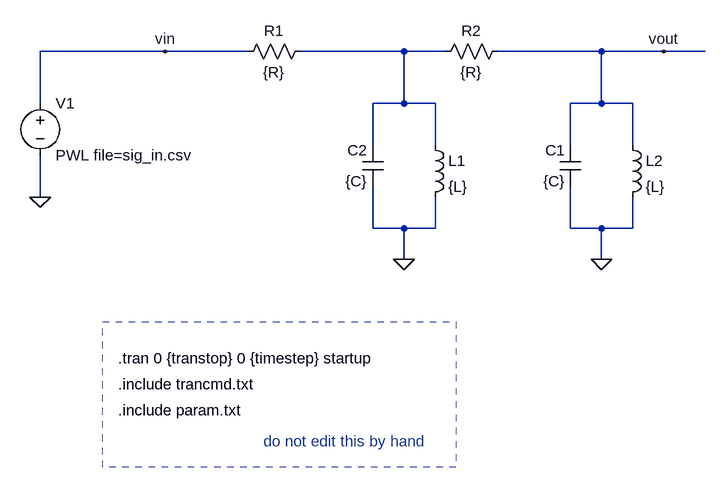
[diagram p0: schematic filter_circuit_2.asc]
filter_circuit_2.asc, the LTspice schematic file:
Version 4
SHEET 1 1364 740
WIRE 304 96 112 96
WIRE 432 96 304 96
WIRE 672 96 512 96
WIRE 736 96 672 96
WIRE 976 96 816 96
WIRE 1072 96 976 96
WIRE 1136 96 1072 96
WIRE 112 176 112 96
WIRE 672 176 672 96
WIRE 672 176 624 176
WIRE 720 176 672 176
WIRE 976 176 976 96
WIRE 976 176 928 176
WIRE 1024 176 976 176
WIRE 624 240 624 176
WIRE 720 240 720 176
WIRE 928 240 928 176
WIRE 1024 240 1024 176
WIRE 112 320 112 256
WIRE 624 368 624 304
WIRE 672 368 624 368
WIRE 720 368 720 320
WIRE 720 368 672 368
WIRE 928 368 928 304
WIRE 976 368 928 368
WIRE 1024 368 1024 320
WIRE 1024 368 976 368
WIRE 672 416 672 368
WIRE 976 416 976 368
FLAG 304 96 vin
FLAG 112 320 0
FLAG 672 416 0
FLAG 1072 96 vout
FLAG 976 416 0
SYMBOL voltage 112 160 R0
WINDOW 39 0 0 Left 0
SYMATTR InstName V1
SYMATTR Value PWL file=sig_in.csv
SYMBOL cap 640 304 R180
WINDOW 0 24 56 Left 2
WINDOW 3 24 8 Left 2
SYMATTR InstName C2
SYMATTR Value {C}
SYMBOL res 416 112 R270
WINDOW 0 32 56 VTop 2
WINDOW 3 0 56 VBottom 2
SYMATTR InstName R1
SYMATTR Value {R}
SYMBOL ind 704 224 R0
SYMATTR InstName L1
SYMATTR Value {L}
SYMBOL cap 944 304 R180
WINDOW 0 24 56 Left 2
WINDOW 3 24 8 Left 2
SYMATTR InstName C1
SYMATTR Value {C}
SYMBOL res 720 112 R270
WINDOW 0 32 56 VTop 2
WINDOW 3 0 56 VBottom 2
SYMATTR InstName R2
SYMATTR Value {R}
SYMBOL ind 1008 224 R0
SYMATTR InstName L2
SYMATTR Value {L}
TEXT 232 568 Left 2 !.tran 0 {transtop} 0 {timestep} startup
TEXT 232 648 Left 2 !.include param.txt
TEXT 232 608 Left 2 !.include trancmd.txt
TEXT 456 696 Left 2 ;do not edit this by hand
RECTANGLE Normal 752 736 208 512 2

The netlist it stands for:
* filter_circuit_2.asc
V1 vin 0 PWL file=sig_in.csv
C2 0 N001 {C}
R1 vin N001 {R}
L1 N001 0 {L}
C1 0 vout {C}
R2 N001 vout {R}
L2 vout 0 {L}
.tran 0 {transtop} 0 {timestep} startup
.include param.txt
.include trancmd.txt
* do not edit this by hand
.backanno
.end